# EAGLE design Controller V0.2 (EAGLE 9.5.1)
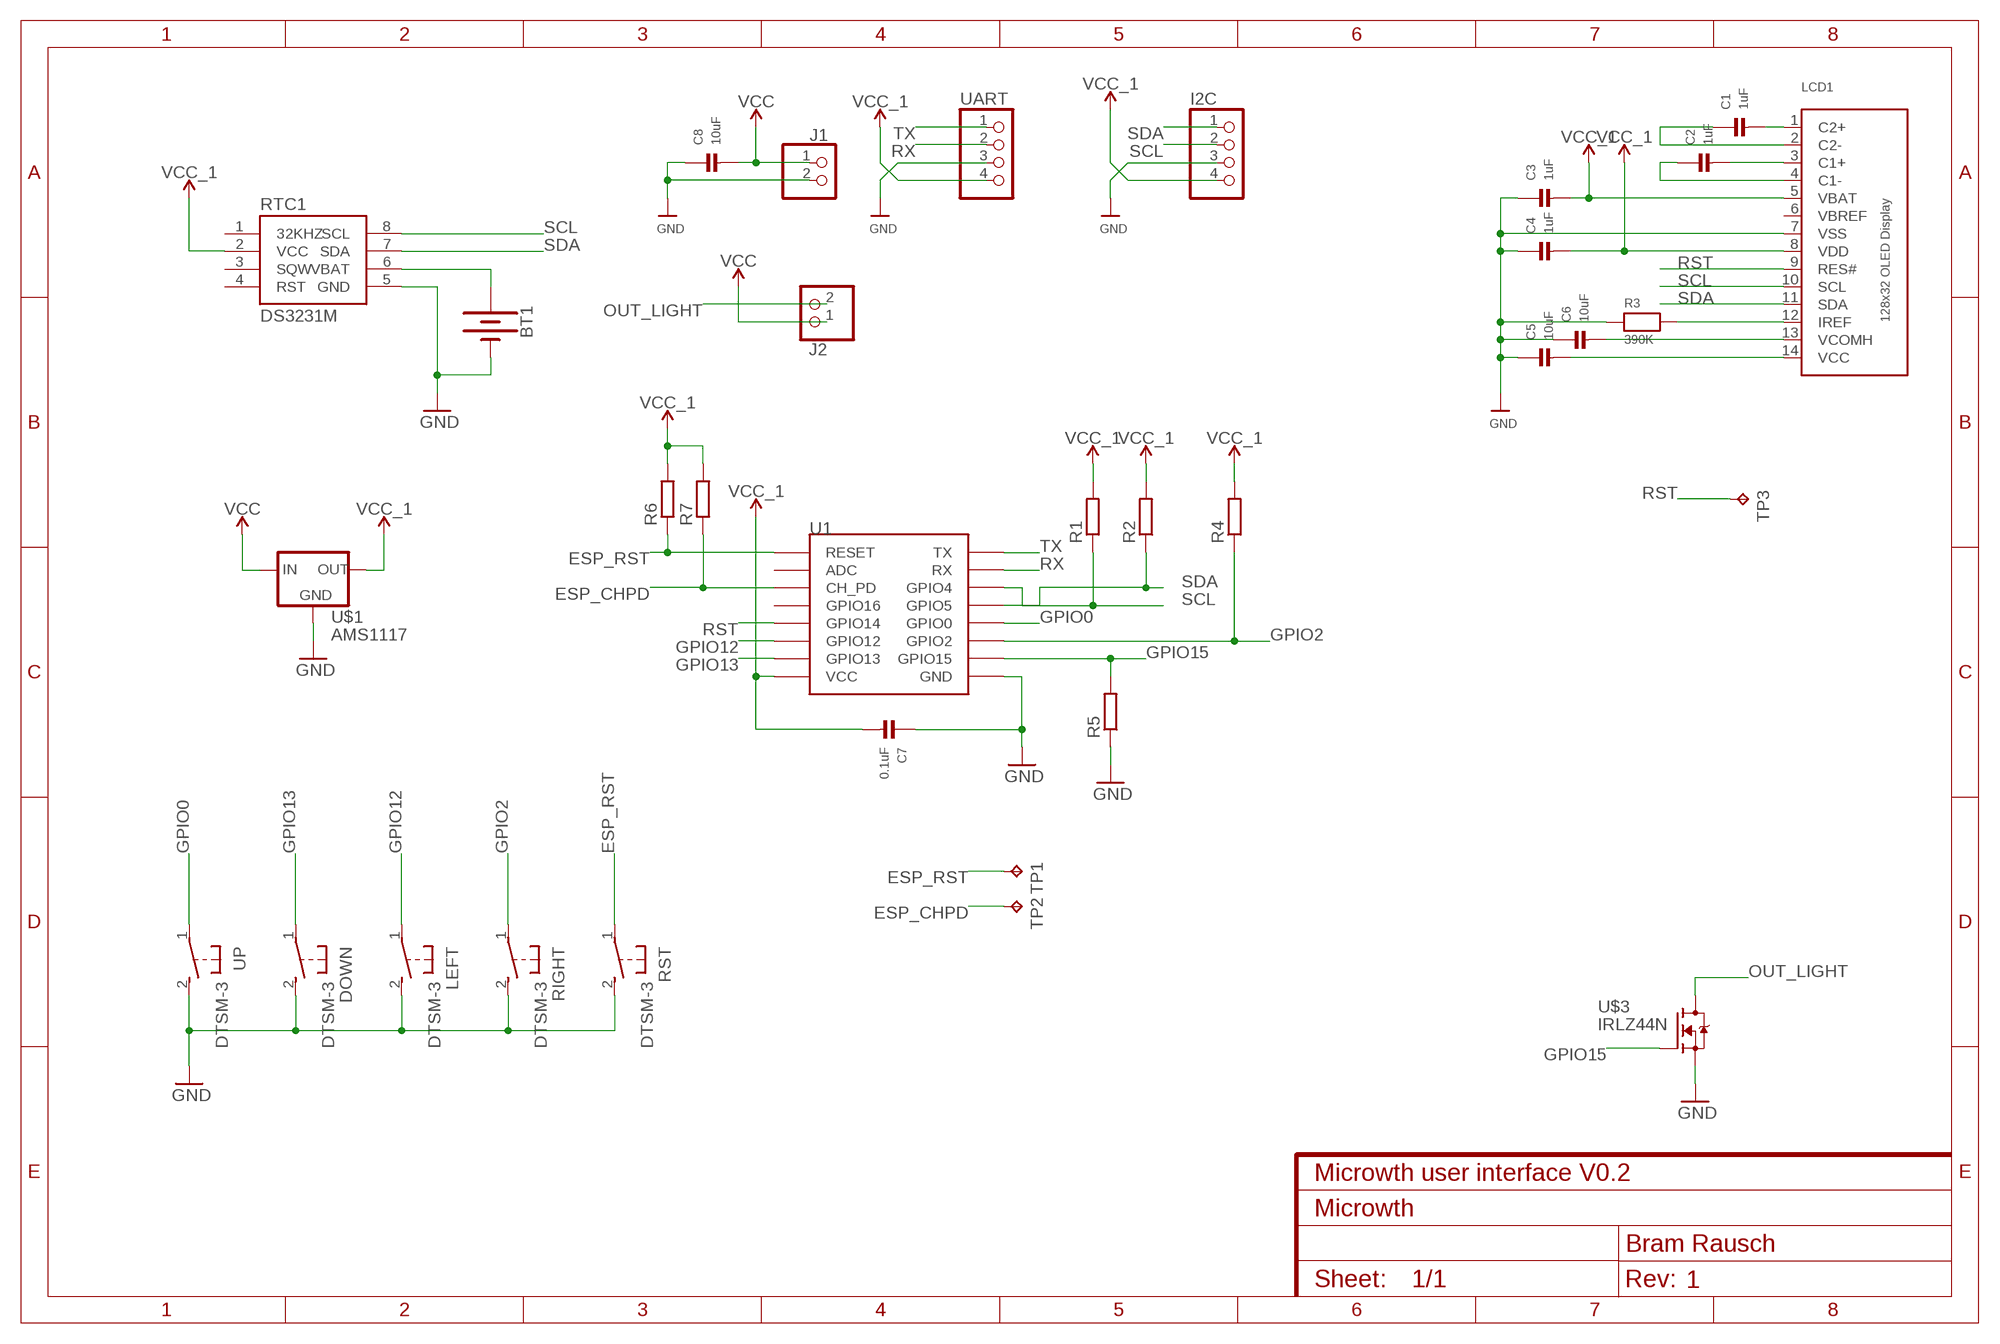
[diagram p0: schematic, sheet 1]
FRAME1 (FRAME-A4L): PROJECT: Microwth; TITLE: Microwth user interface V0.2

## Parts
BT1  BATTERY-20MM_PTH  [BATTCOM_20MM_PTH]
C1  1uF  CAP_CERAMIC0805  [0805]
C2  1uF  CAP_CERAMIC0805  [0805]
C3  1uF  CAP_CERAMIC0805  [0805]
C4  1uF  CAP_CERAMIC0805  [0805]
C5  10uF  CAP_CERAMIC0805  [0805]
C6  10uF  CAP_CERAMIC0805  [0805]
C7  0.1uF  CAP_CERAMIC0805  [0805]
C8  10uF  CAP_CERAMIC0805  [0805]
DOWN  DTSM-3  [DTSM-3]
I2C  PINHD-1X4  [1X04]
J1  PINHD-1X2  [1X02]
J2  PINHD-1X2  [1X02]
LCD1  DISP_OLED_UG-2832HSWEG02  [UG-2832HSWEG02_WRAPUNDER]
LEFT  DTSM-3  [DTSM-3]
R1  R-EU_R0805  [R0805]
R2  R-EU_R0805  [R0805]
R3  390K  RESISTOR0805  [0805]
R4  R-EU_R0805  [R0805]
R5  R-EU_R0805  [R0805]
R6  R-EU_R0805  [R0805]
R7  R-EU_R0805  [R0805]
RIGHT  DTSM-3  [DTSM-3]
RST  DTSM-3  [DTSM-3]
RTC1  DS3231M  [SO08]
TP1  TPB1,27  [B1,27]
TP2  TPB1,27  [B1,27]
TP3  TPB1,27  [B1,27]
U1  ESP12SMD  [ESP12-SMD]
U$1  AMS1117  [SOT223]
U$3  IRLZ44N  [TO220]
UART  PINHD-1X4  [1X04]
UP  DTSM-3  [DTSM-3]

## Nets
ESP_CHPD: R7.1 TP2.TP U1.CH_PD
ESP_RST: R6.1 RST.1 TP1.TP U1.RESET
GND: BT1.2(-) C3.1 C4.1 C5.1 C6.1 C7.1 C8.1 DOWN.2 I2C.3 J1.2 LCD1.7(VSS) LEFT.2 R3.1 R5.1 RIGHT.2 RST.2 RTC1.5(GND) U1.GND U$1.1(GND) U$3.3(S) UART.3 UP.2
GPIO0: U1.GPIO0 UP.1
GPIO2: R4.1 RIGHT.1 U1.GPIO2
GPIO12: LEFT.1 U1.GPIO12
GPIO13: DOWN.1 U1.GPIO13
GPIO15: R5.2 U1.GPIO15 U$3.1(G)
N$1: C1.2 LCD1.1(C2+)
N$2: C1.1 LCD1.2(C2-)
N$3: C2.2 LCD1.3(C1+)
N$4: C2.1 LCD1.4(C1-)
N$5: C6.2 LCD1.13(VCOMH)
N$6: C5.2 LCD1.14(VCC)
N$7: LCD1.12(IREF) R3.2
N$8: BT1.1(+) RTC1.6(VBAT)
OUT_LIGHT: J2.2 U$3.2(D)
RST: LCD1.9(RES#) TP3.TP U1.GPIO14
RX: U1.RXD0(RX) UART.2
SCL: I2C.2 LCD1.10(SCL) R1.1 RTC1.8(SCL) U1.GPIO4
SDA: I2C.1 LCD1.11(SDA) R2.1 RTC1.7(SDA) U1.GPIO5
TX: U1.TXD0(TX) UART.1
VCC: C8.2 J1.1 J2.1 U$1.3(IN)
VCC_1: C3.2 C4.2 C7.2 I2C.4 LCD1.5(VBAT) LCD1.8(VDD) R1.2 R2.2 R4.2 R6.2 R7.2 RTC1.2(VCC) U1.VCC U$1.2(OUT) UART.4
Unconnected: RTC1.1(32KHZ) RTC1.3(SQW) RTC1.4(RST) U1.ADC U1.GPIO16

## Power pins joined to a net without a drawn wire
VBREF: LCD1.6(VBREF)

## Library data of the parts
BT1 = SparkFun-Batteries:BATTERY: Battery - Single Cell A variety of battery chemistries, sizes, and footprints. Device List: 20MM_PTH - Coin Cell Battery Holder - 20mm (PTH) <https://www.sparkfun.com/products/783> 12MM_SMD - Coin Cell Battery Holder - 12mm (SMD) <https://www.sparkfun.com/products/10592> 12MM_PTH - Coin Cell Battery Holder - 12mm (PTH) <https://www.sparkfun.com/products/7948> 20MM_SMD - 20mm Coin Cell Battery Holder (SMD) (2 legs) Used on the Big Time Watch Kit <https://www.sparkfun.com/products/11734> 20MM_SMD_4LEGS - Coin Cell Battery Holder - 20mm (SMD) <https://www.sparkfun.com/products/11892> 20MM_SMD_4LEGS_OVERPASTE - Coin Cell Battery Holder - 20mm (SMD) <https://www.sparkfun.com/products/11892> (Over-paste on the legs) 24.5MM_PTH - Coin Cell Battery Holder - 24.5mm (PTH) <https://www.sparkfun.com/products/8863> 9V - 9V Battery Holder - PC Mount Used on the SparkFun SparkPunk Sound Kit <https://www.sparkfun.com/products/11177> and SparkFun SparkPunk Sequencer Kit <https://www.sparkfun.com/products/12707> 18650 - Battery Holder - 18650 (PTH) <https://www.sparkfun.com/products/13113> AA - Battery Holder - 1xAA (PTH) <https://www.sparkfun.com/products/7949> AAA - Battery Holder - 1xAAA (PTH) <https://www.sparkfun.com/products/12718> AA_KIT - Battery Holder - 1xAA (PTH) <https://www.sparkfun.com/products/7949> Special kit package - pads only have exposed copper on one side of the board. AAA_KIT - Battery Holder - 1xAAA (PTH) <https://www.sparkfun.com/products/12718> Special kit package - pads only have exposed copper on one side of the board.; PROD_ID: BATT-09031; SF_SKU: PRT-00783
C1-C8 = microbuilder:CAP_CERAMIC: Ceramic Capacitors 0402 - 0402 Surface Mount Capacitors 16pF 50V 5% [Digikey: 445-4899-2-ND] 18pF 50V 5% [Digikey: 490-1281-2-ND] 22pF 50V 5% [Digikey: 490-1283-2-ND] 68pF 50V 5% [Digikey: 490-1289-2-ND] 0.1uF 10V 10% [Digikey: 490-1318-2-ND] 1.0uF 6.3V 10% [Digikey: 490-1320-2-ND] 0603 - 0603 Surface Mount Capacitors 16 pF 50V 5% [Digikey: 445-5051-2-ND] 22 pF 50V [Digikey: PCC220ACVTR-ND] 33 pF 50V 5% [Digikey: 490-1415-1-ND] 56pF 50V 5% [Digikey: 490-1421-1-ND] 220pF 50V 5% [Digikey: 445-1285-1-ND] 680 pF 50V 2200 pF 50V 5% C0G [Digikey: 445-1297-1-ND] 5600 pF 100V 5% X7R [Digikey: 478-3711-1-ND] 0.1 µF 25V 10% [Digikey: PCC2277TR-ND] 0.22 µF 16V 10% X7R [Digikey: 445-1318-1-ND] 1.0 µF 25V 10% [Digikey: 445-5146-2-ND] 0603 - RF Specific 3pF 250V +/-0.1pF RF [Digikey: 712-1347-1-ND] 18 pF 250V 5% [Digikey: 478-3505-1-ND or 712-1322-1-ND] 56 pF 250V 5% C0G RF [Digikey: 490-4867-1-ND] 68 pF 250V RF [Digikey: 490-4868-1-ND] 0805 - 0805 Surface Mount Capacitors 220 pF 250V 2% RF Ceramic Capacitor [Digikey: 712-1398-1-ND] 1000 pF 50V 2% NP0 Ceramic Capacitor [Digikey: 478-3760-1-ND] 0.1 µF 25V 10% Ceramic Capacitor [Digikey: PCC1828TR-ND] 1.0 µF 16V 10% Ceramic Capacitor[Digikey: 490-1691-2-ND] 10.0 µF 10V 10% Ceramic Capacitor[Digikey: 709-1228-1-ND] 10.0 uF 16V 10% Ceramic Capacitor [Digikey: 478-5165-2-ND] 47 uF 6.3V 20% Ceramic Capacitor [Digikey: 587-1779-1-ND or 399-5506-1-ND] 1206 - 1206 Surface Mount Capacitors 47uF 10V 20% Ceramic Capacitor [Digikey: 490-5528-1-ND or 399-5508-1-ND or 445-6010-1-ND] 100uF 6.3V -20%, +80% Y5V Ceramic Capacitor (Digikey: 490-4512-1-ND, Mouser: 81-GRM31CF50J107ZE1L)
DOWN LEFT RIGHT RST UP = switch-tact:DTSM-3
I2C UART = pinhead:PINHD-1X4: PIN HEADER
J1 J2 = pinhead:PINHD-1X2: PIN HEADER
LCD1 = microbuilder:DISP_OLED_UG-2832HSWEG02: 128x32 I2C 0.91" Monochrome OLED Display
R1 R2 R4-R7 = rcl:R-EU_: RESISTOR, European symbol; SPICEPREFIX: R
R3 = microbuilder:RESISTOR: Resistors 0402 - 0402 Surface Mount Package 22 Ohm 1% 1/16W [Digikey: 311-22.0LRTR-ND] 33 Ohm 5% 1/16W 1.0K 5% 1/16W 1.5K 5% 1/16W 2.0K 1% 1/16W 10.0K 1% 1/16W [Digikey: 311-10.0KLRTR-ND] 10.0K 5% 1/16W [Digikey: RMCF0402JT10K0TR-ND] 12.1K 1% 1/16W [Digikey: 311-22.0LRTR-ND] 100.0K 5% 1/16W 0603 - 0603 Surface Mount Package 0 Ohm 1/10 Watt 1% Resistor 15 Ohm 1/10 Watt 1% Resistor 33 Ohm 1/10 Watt 1% Resistor 49.9 Ohm 1/10 Watt 1% Resistor 100 Ohm 1/10 Watt 1% Resistor 150 Ohm 1/10 Watt 1% Resistor 240 Ohm 1/10 Watt 1% Resistor 390 Ohm 1/10 Watt 1% Resistor 560 Ohm 1/10 Watt 1% Resistor 680 Ohm 1/10 Watt 1% Resistor 750 Ohm 1/10 Watt 1% Resistor 1.0K Ohm 1/10 Watt 1% Resistor 1.5K Ohm 1/10 Watt 1% Resistor 2.0K Ohm 1/10 Watt 1% Resistor 2.2K Ohm 1/10 Watt 1% Resistor 3.3K Ohm 1/10 Watt 1% Resistor 4.7K Ohm 1/10 Watt 1% Resistor 10.0K Ohm 1/10 Watt 1% Resistor 12.0K Ohm 1/10 Watt 1% Resistor 12.1K Ohm 1/10 Watt 1% Resistor 20.0K Ohm 1/10 Watt 1% Resistor 33.0K Ohm 1/10 Watt 1% Resistor 100.0K Ohm 1/10 Watt 1% Resistor 0805 - 0805 Surface Mount Package 0 Ohm 1/8 Watt 1% Resistor 33 Ohm 1/8 Watt 1% Resistor 100 Ohm 1/8 Watt 1% Resistor 150 Ohm 1/8 Watt 1% Resistor 200 Ohm 1/8 Watt 1% Resistor 240 Ohm 1/8 Watt 1% Resistor 330 Ohm 1/8 Watt 1% Resistor 390 Ohm 1/8 Watt 1% Resistor 470 Ohm 1/8 Watt 1% Resistor 1.0K Ohm 1/8 Watt 1% Resistor 1.5K Ohm 1/8 Watt 1% Resistor 2.0K Ohm 1/8 Watt 1% Resistor 4.7K Ohm 1/8 Watt 1% Resistor 5.1K Ohm 1/8 Watt 1% Resistor 5.6K Ohm 1/8 Watt 1% Resistor 10.0K Ohm 1/8 Watt 1% Resistor 22.0K Ohm 1/8 Watt 1% Resistor 33.0K Ohm 1/8 Watt 1% Resistor 100K Ohm 1/8 Watt 1% Resistor 1206 - 1206 Surface Mount Package 2012 - 2010 Surface Mount Package 0.11 Ohm 1/2 Watt 1% Resistor - Digikey: RHM.11UCT-ND
RTC1 = SparkFun-Clocks:DS3231M: DS3231M Real Time Clock Accuracy +/-5ppm. Battery Backup. 2.3V to 5.5V. Datasheet <https://cdn.sparkfun.com/datasheets/Dev/Beagle/DS3231M.pdf> SparkFun Products CryptoCape <https://www.sparkfun.com/products/12773> (DEV-12773) SparkFun CryptoShield <https://www.sparkfun.com/products/13183> (DEV-13183); PROD_ID: IC-11985
TP1-TP3 = testpad:TP: Test pad
U1 = esp8266modules:ESP12: ESP8266 Wifi module 12
U$1 = SparkFun-IC-Power:AMS1117
U$3 = transistor-fet:IRLZ44N

## Board
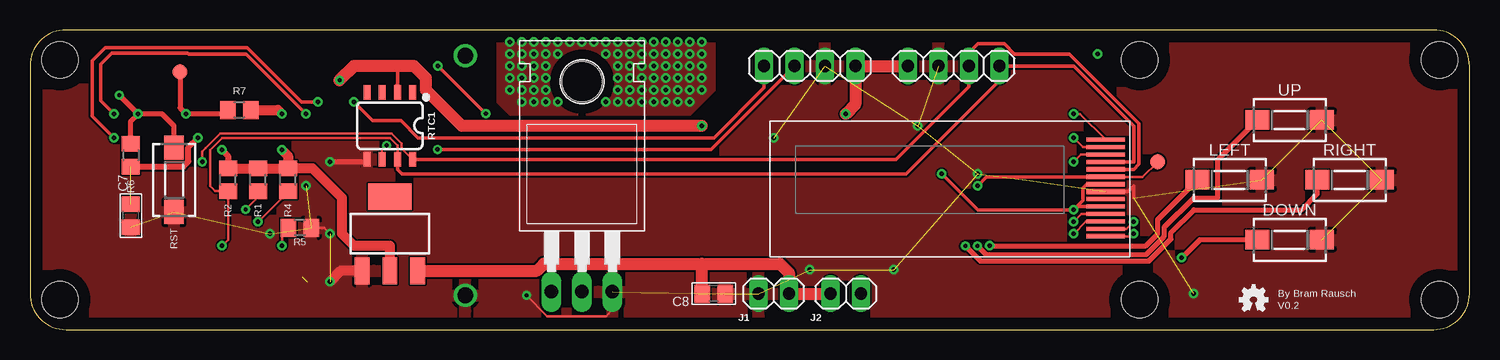
[diagram p1: board, top side]
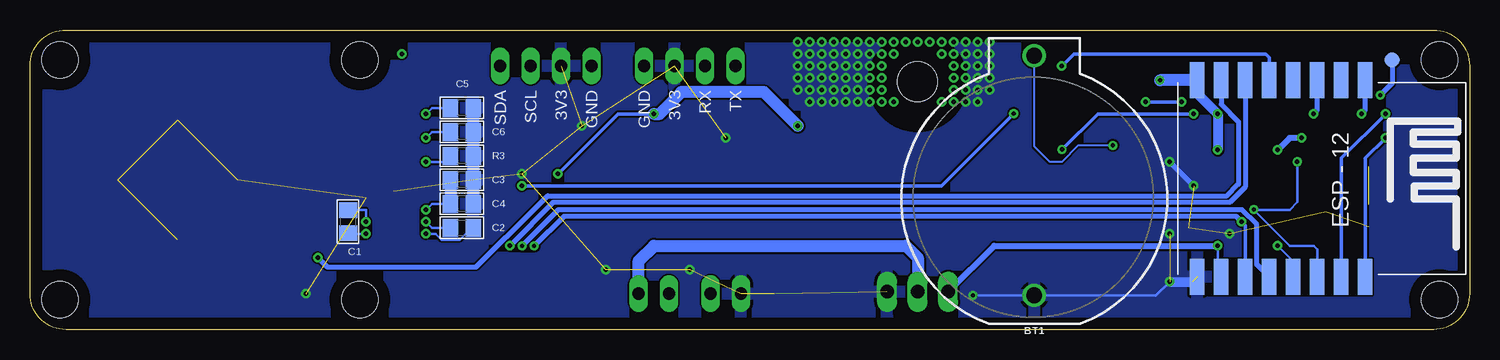
[diagram p2: board, bottom side, seen from below]

Size 120 x 25 mm. Coordinates in mm from the lower left corner, seen from the top.
Outline: 0,22 0,3 arc90 3,0 117,0 arc90 120,3 120,22 arc90 117,25 3,25 arc90 0,22
Copper layers (1*16): Top 0.035mm / dielectric 1.5mm / Bottom 0.035mm
Design rules "default": minimum track width 6mil, minimum drill 0.35mm, track to track 6mil, track to pad 6mil, pad to pad 6mil, via to via 6mil, smd to smd 6mil, copper to edge 40mil, drill to drill 6mil, minimum pad ring 10mil, minimum via ring 8mil, stop-mask expansion 4mil, vias tented up to drill 0mil, thermal gap 10mil
Holes 3 mm at 2.5,22.5 2.5,2.5 117.5,22.5 117.5,2.5 92.5,22.5 92.5,2.5

### Footprints (pad centres in the part's own frame; a part is rotated, then mirrored left to right if it is on the bottom)
BATTCOM_20MM_PTH = drill 1.3: 1 11.85,0; 2 -8.15,0
0805 = smd 1.3 x 1.5: 1 -0.95,0; 2 0.95,0
DTSM-3 = smd 2 x 1.6: 1 -2.7,0; 2 2.7,0
1X04 = drill 1.016 long: 1 -3.81,0; 2 -1.27,0; 3 1.27,0; 4 3.81,0
1X02 = drill 1.016 long: 1 -1.27,0; 2 1.27,0
UG-2832HSWEG02_WRAPUNDER = smd 3.2 x 0.35: 1 14.678,-4.713; 2 14.678,-4.093; 3 14.678,-3.473; 4 14.678,-2.853; 5 14.678,-2.233; 6 14.678,-1.613; 7 14.678,-0.993; 8 14.678,-0.373; 9 14.678,0.247; 10 14.678,0.867; 11 14.678,1.487; 12 14.678,2.107; 13 14.678,2.727; 14 14.678,3.347
R0805 = smd 1.3 x 1.5: 1 -0.95,0; 2 0.95,0
SO08 = smd 0.6 x 1.2: 1 -1.905,-2.8; 2 -0.635,-2.8; 3 0.635,-2.8; 4 1.905,-2.8; 5 1.905,2.8; 6 0.635,2.8; 7 -0.635,2.8; 8 -1.905,2.8
B1,27 = smd 1.27 x 1.27: TP 0,0
ESP12-SMD = smd 3 x 1.2: ADC -8.3,3.8; CH_PD -8.3,1.8; GND 8.1,-8.2; GPIO0 8.1,-2.2; GPIO2 8.1,-4.2; GPIO4 8.1,1.8; GPIO5 8.1,-0.2; GPIO12 -8.3,-4.2; GPIO13 -8.3,-6.2; GPIO14 -8.3,-2.2; GPIO15 8.1,-6.2; GPIO16 -8.3,-0.2; RESET -8.3,5.8; RXD0 8.1,3.8; TXD0 8.1,5.8; VCC -8.3,-8.2
SOT223 = smd 1.219 x 2.235: 1 -2.311,-3.099; 2 0,-3.099; 3 2.311,-3.099 | smd 3.6 x 2.2: 4 0,3.099
TO220 = drill 1.118 long: 1 -2.54,-6.35; 2 0,-6.35; 3 2.54,-6.35 | hole 3.302: 0,11.176

### Placement (x,y rotation side)
BT1  36.28,11 90 bottom
C1  93.5,9 270 bottom
C2  84,8.5 0 bottom
C3  84,12.5 180 bottom
C4  84,10.5 180 bottom
C5  84,18.5 180 bottom
C6  84,16.5 180 bottom
C7  8.41,9.5 90 top
C8  57,3 180 top
DOWN  105,7.5 0 top
I2C  77,22 180 top
J1  62,3 180 top
J2  68,3 0 top
LCD1  75,12.5 0 top
LEFT  100,12.5 0 top
R1  19,12.5 90 top
R2  16.5,12.5 90 top
R3  84,14.5 180 bottom
R4  21.5,12.5 90 top
R5  22.5,8.5 180 top
R6  8.41,14.55 270 top
R7  17.45,18.33 0 top
RIGHT  110,12.5 0 top
RST  12,12.5 270 top
RTC1  30,17 180 top
TP1  6.45,22.5 0 bottom
TP2  12.5,21.5 0 top
TP3  94,14 0 top
U1  14.5,12.5 270 bottom
U$1  30,8 0 top
U$3  46.01,9.5 0 top
U$4  [OSHW-LOGO-MINI]  102,2.5 0 top
UART  65,22 0 top
UP  105,17.5 0 top

### Tracks (layer width: path | path; a pad name or v marks a point on that pad's centre or on a via)
ESP_CHPD  (via drill 0.35)
  Top 0.203: R7.1 16.17,18
  Top 0.406: 16.17,18 v13,18 12.5,18.5 TP2.TP
  Bottom 0.203: U1.CH_PD 13,20.5
  Bottom 0.406: v13,18 12.7,18.3 U1.CH_PD
ESP_RST  (via drill 0.35)
  Top 0.406: RST.1 12,17 11,18 v9,18 | v7.45,19.55 v9,18 | R6.1 8.41,17.41 v9,18
  Bottom 0.406: v9,18 8.7,18.3 U1.RESET | TP1.TP 6.45,20.55 v7.45,19.55
GND  (via drill 0.35)  (22 unrouted)
  Top 0.203: R5.1 24.5,8.5 v25,8 | v41.39,2.85 43.12,1.12 48,1.12 48.55,1.67 U$3.3
  Top 0.3: LCD1.7 91.51,11.51 92,12 92,11
  Top 0.4: RTC1.5 27.89,14 v25,14
  Top 0.813: U$1.1 25.9,4.9 v25,4
  Bottom 0.203: v41.39,2.85 BT1.2 26.15,2.85
  Bottom 0.254: 26.15,2.85 v25,4
  Bottom 0.4: v25,14 v23,12
  Bottom 0.813: v25,4 23.1,4
  Bottom 1: R3.1 C3.1 C4.1
  Bottom 1.016: R3.1 C6.1 C5.1
  other vias: 20,8 65,5 72,5 79,13 97,3 62,16 74,17
  pour Top: 0,0 0,26 120,26 121,25 121,0 120,-1 1,-1
  pour Bottom: -2,-2 -3,-1 -3,27 -2,28 123,28 123,-1 121,-3 -1,-3
GPIO0  (via drill 0.35)
  Top 0.4: UP.1 99,14.2 99,11 97,11 94.55,8.55 94.55,7.77 93.05,6.27 79.7,6.27 v78.98,6.98
  Bottom 0.4: U1.GPIO0 17.75,5.45 17.75,8.78 18.97,10 75.97,10 v78.98,6.98
GPIO2  (via drill 0.35)
  Top 0.203: R4.1 21.5,11.5 v19,9
  Top 0.4: v77.97,6.97 79.22,5.72 93.28,5.72 95.11,7.54 95.11,8.11 97,10 106,10 107.3,11.3 RIGHT.1
  Bottom 0.3: U1.GPIO2 18.7,8.7 v19,9
  Bottom 0.4: v19,9 19.45,9.45 75.49,9.45 v77.97,6.97
GPIO12  (via drill 0.35)
  Top 0.4: LEFT.1 94,9.2 94,8 93,7 v80,7
  Bottom 0.4: U1.GPIO12 18.7,11.91 20,10.61 76.39,10.61 v80,7
GPIO13  (via drill 0.35)
  Top 0.4: DOWN.1 97.5,7.5 v96,6
  Bottom 0.4: U1.GPIO13 20.7,18.77 19.25,17.33 19.25,12.13 20.23,11.16 76.84,11.16 80.27,7.73 80.3,7.73 82.82,5.22 95.22,5.22 v96,6
GPIO15  (via drill 0.35)
  Top 0.203: R5.2 21,7.95 v21,7
  Bottom 0.203: v21,7 21,4.7 U1.GPIO15
  Bottom 0.508: U$3.1 39.62,7 v21,7
N$1  (via drill 0.35)
  Top 0.2: LCD1.1 91.79,7.79 v92,8
  Bottom 0.2: v92,8 93.45,8 C1.2
N$2  (via drill 0.35)
  Top 0.2: LCD1.2 91.41,8.41 v92,9
  Bottom 0.2: v92,9 92,10 93.45,10 C1.1
N$3  (via drill 0.35)
  Top 0.2: v87,8 88.03,9.03 LCD1.3
  Bottom 0.2: C2.2 83.19,8.5 84.19,7.5 85.7,7.5 86.21,8 v87,8
N$4  (via drill 0.35)
  Top 0.2: LCD1.4 87.65,9.65 v87,9
  Bottom 0.2: v87,9 86.5,8.5 C2.1
N$5  (via drill 0.35)
  Top 0.2: LCD1.13 87.77,15.23 v87,16
  Bottom 0.2: v87,16 86.5,16.5 C6.2
  Bottom 0.254: 84.98,16.54 C6.2
N$6  (via drill 0.35)
  Top 0.2: LCD1.14 87.53,18 v87,18
  Bottom 0.2: v87,18 86.5,18.5 C5.2
N$7  (via drill 0.35)
  Top 0.2: LCD1.12 87.61,14.61 v87,14
  Bottom 0.2: v87,14 85.45,14 R3.2
N$8  (via drill 0.35)
  Top 0.152: RTC1.6 29.36,14.99 v29.74,15.37
  Bottom 0.152: v29.74,15.37 32.63,15.37 34,14 35,14 36.28,15.28 BT1.1
N$9  (via drill 0.35)
  other vias: 89,23
NONE  (via drill 0.35)
  other vias: 41,19 40,20 40,21 40,22 40,23 40,24 41,24 41,23 41,22 41,21 41,20 42,20 42,19 43,19 44,19 43,20 43,21 43,22 44,23 43,23 42,23 42,22 42,21 42,24 43,24 44,24 45,24 46,24 47,24 48,24 49,24 50,24 51,24 52,24 53,24 54,24 55,24 56,24 56,23 56,22 56,21 56,20 55,19 54,19 53,19 52,19 51,19 50,19 49,19 49,20 48,19 49,21 49,22 48,23 49,23 50,23 50,22 50,21 50,20 51,20 51,21 51,22 51,23 52,23 53,23 54,23 55,23 55,22 54,22 53,22 52,22 52,21 52,20 53,20 53,21 54,21 54,20 55,20 55,21
  pour Top: 39,25 39,19 40,18 55,18 57,20 57,25
  pour Bottom: 39,25 39,19 40,18 55,18 57,20 57,25
OUT_LIGHT
  Bottom 1.016: J2.2 69.27,5.73 68,7 47,7 46,6 U$3.2
RST  (via drill 0.35)
  Top 0.2: LCD1.9 90,12.75 92.75,12.75 TP3.TP
  Top 0.3: v34,22 37.97,18.03 v38,18.03 | v79,12 79.75,12.75 90,12.75
  Bottom 0.3: U1.GPIO14 16.7,22.7 17,23 33,23 v34,22 | v38,18.03 44.03,12 v79,12
RX  (via drill 0.35)
  Top 0.3: UART.2 56.77,15.04 v33.96,15.04
  Top 0.305: v23,18 18,23 13.23,23 13.15,23.07 6.8,23.07 5.88,22.15 5.88,19.12 v7,18
  Bottom 0.3: v33.96,15.04 31,18
  Bottom 0.305: U1.RXD0 10.7,14.3 v7,18 | v23,18 31,18
SCL  (via drill 0.35)
  Top 0.152: 32.1,14 RTC1.8
  Top 0.2: v17.97,10.03 19,11.07 R1.1 | 14.64,15.15 14.37,14.87 v14.37,14
  Top 0.203: RTC1.8 30.99,15.11 30.99,15.51 30.15,16.36 15.85,16.36 14.64,15.15
  Top 0.3: LCD1.10 92.01,13.37 92.45,13.81 92.45,17.19 86.64,23 82.08,23 81.24,23.83 79,23.83 78.27,23.1 I2C.2 78.27,20.27 72.2,14.2 RTC1.8
  Bottom 0.2: 18,10 15,7 13,7 12.7,6.7 U1.GPIO4 | 18,10 v17.97,10.03 | v14.37,14 14.37,10.63 15,10 18,10
SDA  (via drill 0.35)
  Top 0.2: 89.69,14 91,14 | 15,15 15,12 15.45,11.55 R2.1 16.5,7.5 v16,7
  Top 0.203: RTC1.7 30.64,15.37 30,16 16,16 15,15
  Top 0.3: LCD1.11 89.69,14 92,14 92,17 87,22 81,22 | 81,22 I2C.1 | RTC1.7 30.64,13.37 31,13 73,13 81,21 81,22
  Bottom 0.2: U1.GPIO5 14.7,5.7 v16,7
TX  (via drill 0.35)
  Top 0.3: 32.37,16 57,16 61.19,20.19 UART.1
  Top 0.305: 32.37,16 30.95,17.42 28.58,17.42 v27,19 | v24,19 22.65,19 18.11,23.53 6.28,23.53 5.17,22.42 5.17,17.83 v7,16
  Bottom 0.305: v27,19 v24,19 | v7,16 8.7,14.3 U1.TXD0
VCC
  Top 1: C8.2 56,3.05 56,5.49
  Top 1.016: U$1.3 42.26,4.9 42.85,5.49 56,5.49 62.51,5.49 63.27,4.73 J1.1 J2.1
VCC_1  (via drill 0.35)  (1 unrouted)
  Top 0.2: 87.83,10.83 87.83,11.79 88.17,12.13 89,12.13 LCD1.8
  Top 0.3: 87.27,10.27 v87,10 79,10 v76,13 | 87.27,10.27 87.78,10.78 87.78,11.81 88.09,12.13 89,12.13 | LCD1.5 87.27,10.27 | RTC1.2 30.64,21.64 31,22
  Top 0.4: RTC1.2 30.64,20.36
  Top 0.508: v14,16 13.21,15.21 13.21,14.03 12.78,13.6 R6.2 | v16,15 16.5,14.5 R2.2
  Top 0.813: R2.2 R1.2 R4.2 | R7.2 20.67,18.33 v21,18 | v21,15 21.5,14.5 R4.2 | U$1.2 30,7 27,7 26,8 26,11 23.55,13.45 R4.2
  Top 1: v56,17 36,17 33,20 33,21 32,22 31,22 27,22 v25.8,20.8 | I2C.4 UART.4 68.81,18.81 v68,18
  Bottom 0.2: C4.2 86.5,10.5 v87,10
  Bottom 0.3: v68,18 71,18 v76,13
  Bottom 0.508: v14,16 15,16 v16,15
  Bottom 0.813: v21,15 v21,18 22.7,19.7 U1.VCC
  Bottom 1: U1.VCC v25.8,20.8 | v56,17 58.82,19.82 65.69,19.82 67.51,18 v68,18 | C3.2 C4.2

### Text on the board
tNames: By Bram Rausch | V0.2
bNames: TX | RX | 3V3 | GND | GND | 3V3 | SCL | SDA